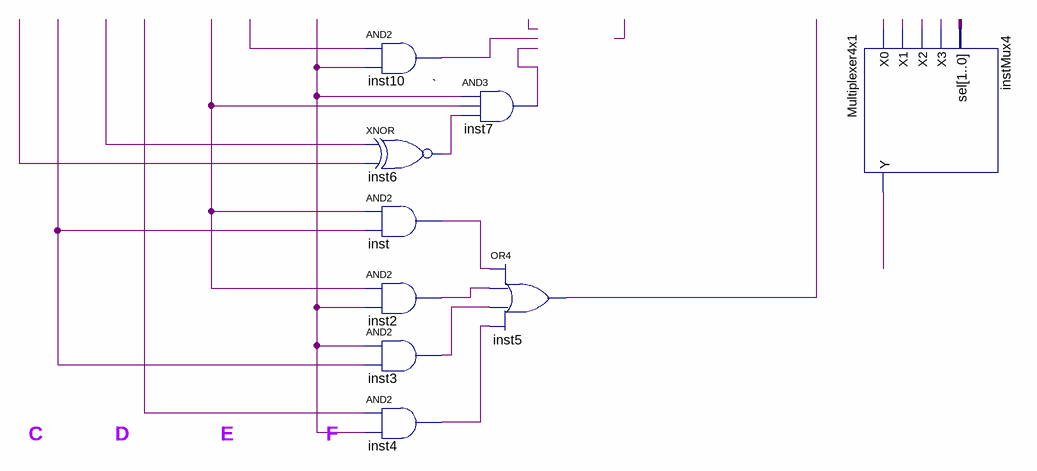
[diagram p0: schematic sheet]
// Quartus schematic majorita3.bdf as structural Verilog: 9 symbols, 0 pins
module majorita3 (
);

  wire \` , inst2_out, inst3_out, inst4_out, inst5_out, inst6_out, inst7_out, inst10_out, inst_out,
       instMux4_y, undriven, undriven_2, undriven_3, undriven_4, undriven_5, undriven_6, undriven_8,
       undriven_9, undriven_10, undriven_11;
  wire [1:0] undriven_7;

  and inst10 (inst10_out, undriven_3, \` );
  xnor inst6 (inst6_out, undriven, undriven_2);
  and inst (inst_out, undriven_6, undriven_5);
  and inst2 (inst2_out, undriven_6, \` );
  and inst3 (inst3_out, \` , undriven_5);
  and inst4 (inst4_out, undriven_4, \` );
  and inst7 (inst7_out, \` , undriven_6, inst6_out);
  or inst5 (inst5_out, inst_out, inst2_out, inst3_out, inst4_out);
  Multiplexer4x1 instMux4 (
    .X0(undriven_8), .X1(undriven_9), .X2(undriven_10), .X3(undriven_11), .sel(undriven_7), .Y(instMux4_y));

  // Notes on the sheet:
  //   C
  //   D
  //   E
  //   F
endmodule
